# EAGLE schematic IRM AC:DC (EAGLE 7.6.0)
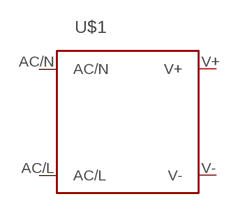
[diagram p0: schematic, sheet 1]

## Parts
U$1  IRM_01/02_SMDIRM_01/02_SMD  [IRM_01/02_SMD]
Unconnected: U$1.AC/L U$1.AC/N U$1.V+ U$1.V-

## Library data of the parts
U$1 = meanwell_irm_v7:IRM_01/02_SMD: 1 or 2 watt housing & pin compatible IRM 01 Vout [V] Imax [A] Pmax [W] Eff [%] 3.3 0.3 1 66 5 0.2 1 70 9 0.111 1 72 12 0.083 1 74 15 0.067 1 75 24 0.042 1 77 IRM 2 Vout [V] Imax [A] Pmax [W] Eff [%] 3.3 0.6 2 66 5 0.4 2 70 9 0.222 2 72 12 0.167 2 74 15 0.133 2 75 24 0.087 2 77